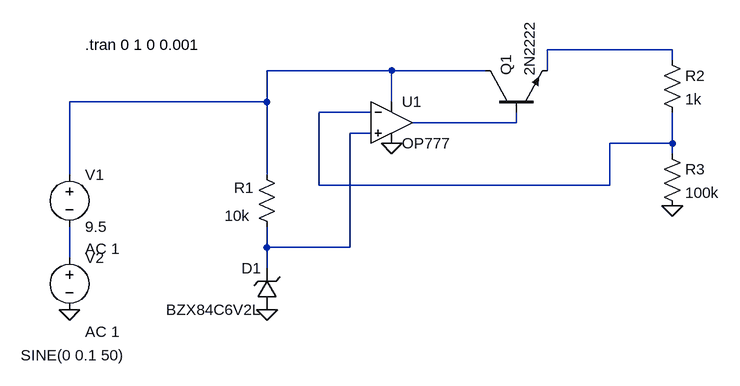
[diagram p0: schematic Regulador_conOperacional.asc]
Regulador_conOperacional.asc, the LTspice schematic file:
Version 4.1
SHEET 1 880 680
WIRE 672 -16 480 -16
WIRE 672 0 672 -16
WIRE 240 16 48 16
WIRE 384 16 240 16
WIRE 480 16 480 -16
WIRE 48 64 48 16
WIRE 48 64 -256 64
WIRE 240 64 240 16
WIRE 208 80 128 80
WIRE 432 96 432 80
WIRE 432 96 272 96
WIRE 208 112 176 112
WIRE 672 128 672 80
WIRE 672 128 576 128
WIRE 672 144 672 128
WIRE -256 176 -256 64
WIRE 48 176 48 64
WIRE 128 192 128 80
WIRE 576 192 576 128
WIRE 576 192 128 192
WIRE 48 288 48 256
WIRE 176 288 176 112
WIRE 176 288 48 288
WIRE -256 304 -256 256
WIRE 48 320 48 288
FLAG 672 224 0
FLAG 48 384 0
FLAG -256 384 0
FLAG 240 128 0
DATAFLAG 544 -16 ""
DATAFLAG 224 16 ""
DATAFLAG 160 288 ""
DATAFLAG 384 192 ""
SYMBOL res 64 272 R180
WINDOW 0 36 76 Left 2
WINDOW 3 42 33 Left 2
SYMATTR InstName R1
SYMATTR Value 10k
SYMBOL npn 384 80 R270
SYMATTR InstName Q1
SYMATTR Value 2N2222
SYMBOL res 656 -16 R0
SYMATTR InstName R2
SYMATTR Value 1k
SYMBOL res 656 128 R0
SYMATTR InstName R3
SYMATTR Value 100k
SYMBOL zener 64 384 R180
WINDOW 0 24 64 Left 2
WINDOW 3 24 0 Left 2
SYMATTR InstName D1
SYMATTR Value BZX84C6V2L
SYMBOL voltage -256 160 R0
WINDOW 123 24 130 Left 2
WINDOW 39 0 0 Left 0
SYMATTR Value2 AC 1
SYMATTR InstName V1
SYMATTR Value 9.5
SYMBOL voltage -256 288 R0
WINDOW 3 -75 166 Left 2
WINDOW 123 24 130 Left 2
WINDOW 39 0 0 Left 0
SYMATTR Value SINE(0 0.1 50)
SYMATTR Value2 AC 1
SYMATTR InstName V2
SYMBOL OpAmps\\OP777 240 32 R0
SYMATTR InstName U1
TEXT -232 -24 Left 2 !.tran 0 1 0 0.001

The netlist it stands for:
* Regulador_conOperacional.asc
R1 N005 N002 10k
Q1 N002 N004 N001 0 2N2222
R2 N001 N003 1k
R3 N003 0 100k
D1 0 N005 BZX84C6V2L
V1 N002 N006 9.5 AC 1
V2 N006 0 SINE(0 0.1 50) AC 1
X§U1 N005 N003 N002 0 N004 OP777  ; pins In+ In- V+ V- OUT
.model D D
.lib standard.dio
.model NPN NPN
.model PNP PNP
.lib standard.bjt
.tran 0 1 0 0.001
.lib ADI.lib
.backanno
.end